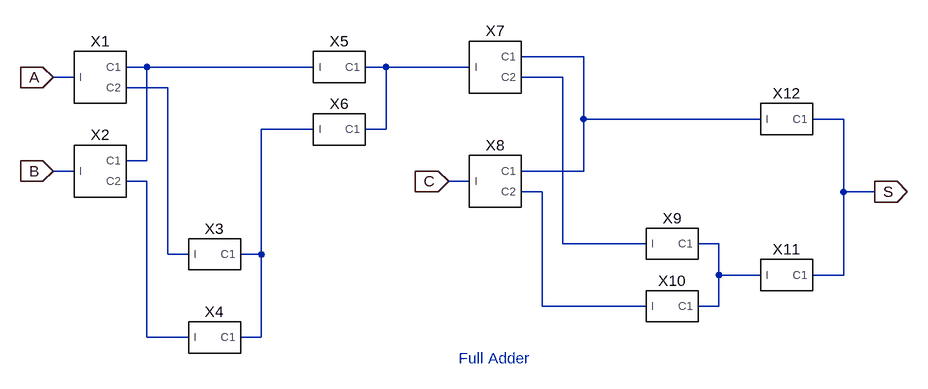
[diagram p0: schematic fag0p0.asc]
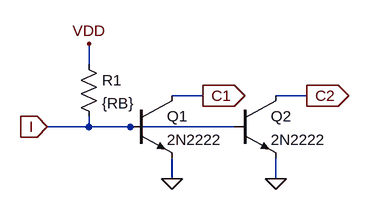
[diagram p1: sub-circuit iilg2.asc]
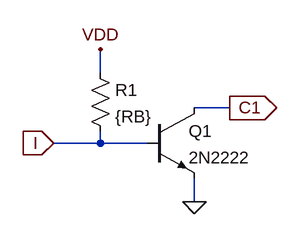
[diagram p2: sub-circuit iilg1.asc]
fag0p0.asc, the LTspice schematic file:
Version 4
SHEET 1 4164 944
WIRE 1104 -272 1008 -272
WIRE 432 -256 400 -256
WIRE 688 -256 432 -256
WIRE 800 -256 768 -256
WIRE 928 -256 800 -256
WIRE 320 -240 288 -240
WIRE 1072 -240 1008 -240
WIRE 464 -224 400 -224
WIRE 1104 -176 1104 -272
WIRE 1376 -176 1104 -176
WIRE 1504 -176 1456 -176
WIRE 688 -160 608 -160
WIRE 800 -160 800 -256
WIRE 800 -160 768 -160
WIRE 432 -112 432 -256
WIRE 432 -112 400 -112
WIRE 320 -96 288 -96
WIRE 1104 -96 1104 -176
WIRE 1104 -96 1008 -96
WIRE 432 -80 400 -80
WIRE 928 -80 896 -80
WIRE 1040 -64 1008 -64
WIRE 1504 -64 1504 -176
WIRE 1552 -64 1504 -64
WIRE 1072 16 1072 -240
WIRE 1200 16 1072 16
WIRE 1312 16 1280 16
WIRE 464 32 464 -224
WIRE 496 32 464 32
WIRE 608 32 608 -160
WIRE 608 32 576 32
WIRE 1312 64 1312 16
WIRE 1376 64 1312 64
WIRE 1504 64 1504 -64
WIRE 1504 64 1456 64
WIRE 1040 112 1040 -64
WIRE 1200 112 1040 112
WIRE 1312 112 1312 64
WIRE 1312 112 1280 112
WIRE 432 160 432 -80
WIRE 496 160 432 160
WIRE 608 160 608 32
WIRE 608 160 576 160
FLAG 288 -240 A
IOPIN 288 -240 In
FLAG 288 -96 B
IOPIN 288 -96 In
FLAG 896 -80 C
IOPIN 896 -80 In
FLAG 1552 -64 S
IOPIN 1552 -64 Out
SYMBOL iilg2 352 -240 R0
SYMATTR InstName X1
SYMBOL iilg2 352 -96 R0
SYMATTR InstName X2
SYMBOL iilg2 960 -256 R0
SYMATTR InstName X7
SYMBOL iilg1 1232 16 R0
SYMATTR InstName X9
SYMBOL iilg1 1232 112 R0
SYMATTR InstName X10
SYMBOL iilg1 1408 64 R0
SYMATTR InstName X11
SYMBOL iilg1 1408 -176 R0
SYMATTR InstName X12
SYMBOL iilg2 960 -80 R0
SYMATTR InstName X8
SYMBOL iilg1 528 32 R0
SYMATTR InstName X3
SYMBOL iilg1 528 160 R0
SYMATTR InstName X4
SYMBOL iilg1 720 -256 R0
SYMATTR InstName X5
SYMBOL iilg1 720 -160 R0
SYMATTR InstName X6
TEXT 912 192 Left 2 ;Full Adder

iilg2.asc, the sub-circuit schematic file:
Version 4
SHEET 1 880 680
WIRE 384 240 384 208
WIRE 560 288 512 288
WIRE 720 288 672 288
WIRE 384 336 384 320
WIRE 384 336 320 336
WIRE 448 336 384 336
WIRE 608 336 448 336
WIRE 512 416 512 384
WIRE 672 416 672 384
FLAG 384 208 VDD
FLAG 320 336 I
IOPIN 320 336 In
FLAG 512 416 0
FLAG 560 288 C1
IOPIN 560 288 Out
FLAG 672 416 0
FLAG 720 288 C2
IOPIN 720 288 Out
SYMBOL npn 448 288 R0
SYMATTR InstName Q1
SYMATTR Value 2N2222
SYMBOL res 368 224 R0
SYMATTR InstName R1
SYMATTR Value {RB}
SYMBOL npn 608 288 R0
SYMATTR InstName Q2
SYMATTR Value 2N2222

iilg1.asc, the sub-circuit schematic file:
Version 4
SHEET 1 880 680
WIRE 384 240 384 208
WIRE 560 288 512 288
WIRE 384 336 384 320
WIRE 384 336 320 336
WIRE 448 336 384 336
WIRE 512 416 512 384
FLAG 512 416 0
FLAG 384 208 VDD
FLAG 320 336 I
IOPIN 320 336 In
FLAG 560 288 C1
IOPIN 560 288 Out
SYMBOL npn 448 288 R0
SYMATTR InstName Q1
SYMATTR Value 2N2222
SYMBOL res 368 224 R0
SYMATTR InstName R1
SYMATTR Value {RB}

The netlist it stands for:
* fag0p0.asc
XX1 A N002 N005 iilg2
XX2 B N002 N007 iilg2
XX7 N003 N001 N004 iilg2
XX9 N004 N009 iilg1
XX10 N008 N009 iilg1
XX11 N009 S iilg1
XX12 N001 S iilg1
XX8 C N001 N008 iilg2
XX3 N005 N006 iilg1
XX4 N007 N006 iilg1
XX5 N002 N003 iilg1
XX6 N006 N003 iilg1

* block symbol definitions
.subckt iilg2 I C1 C2
Q1 C1 I 0 0 2N2222
R1 VDD I {RB}
Q2 C2 I 0 0 2N2222
.ends iilg2

.subckt iilg1 I C1
Q1 C1 I 0 0 2N2222
R1 VDD I {RB}
.ends iilg1

.model NPN NPN
.model PNP PNP
.lib standard.bjt
* Full Adder
.backanno
.end